# Altium project Universal_Full_Bridge.PrjPcb
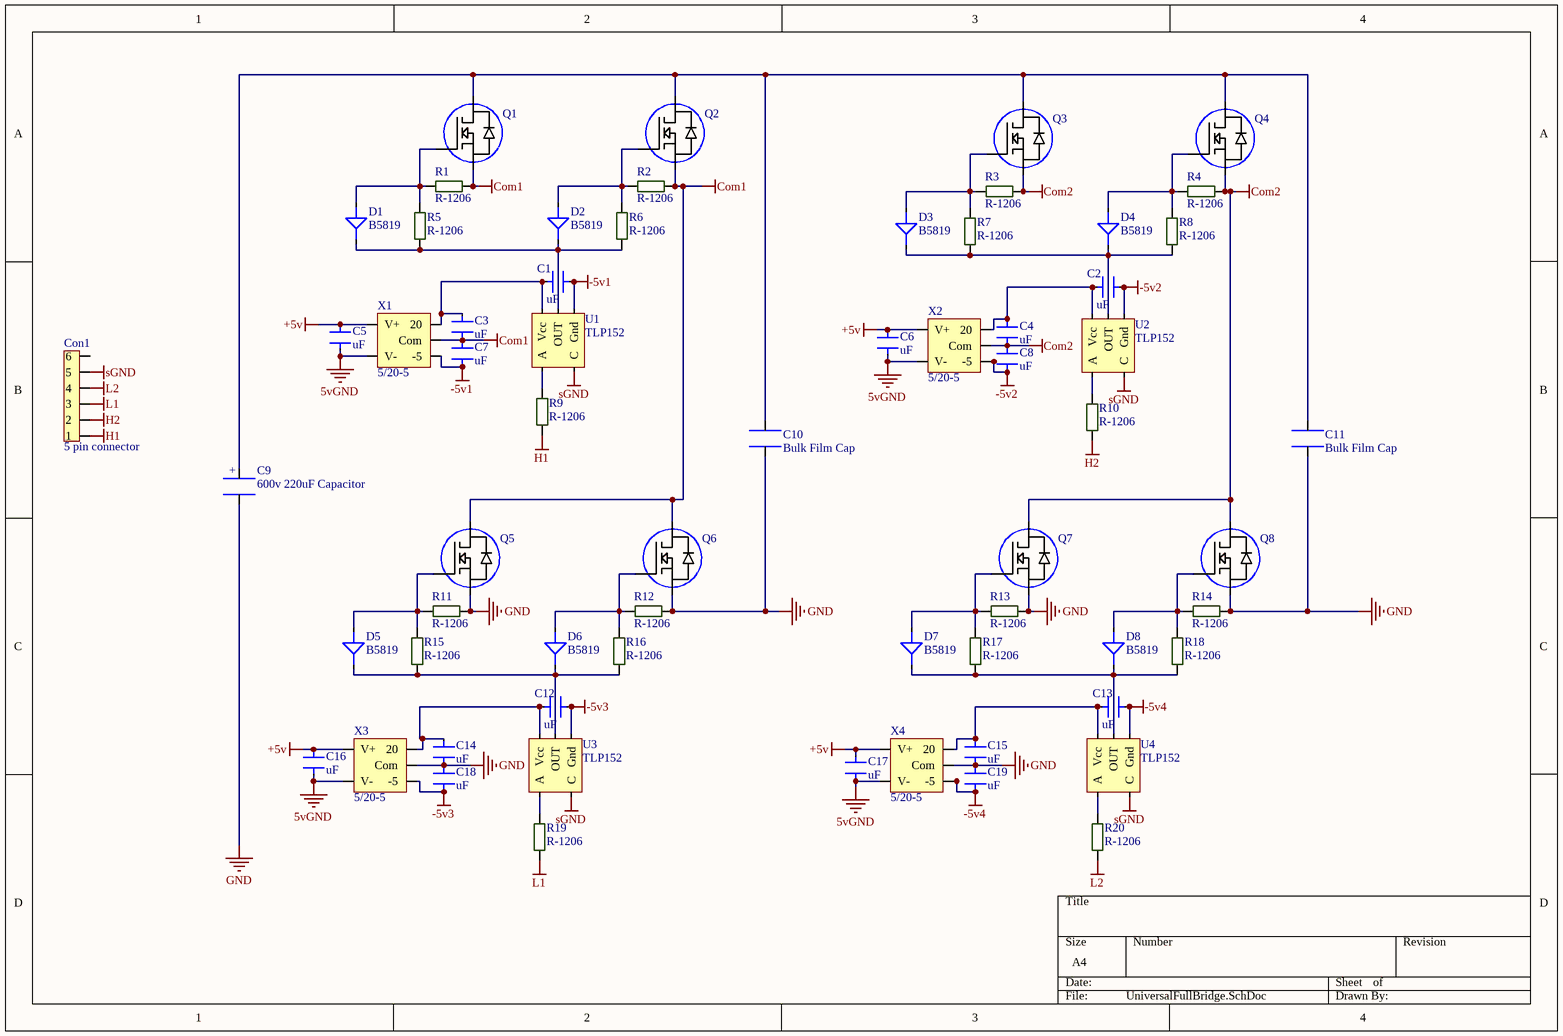
[diagram p0: UniversalFullBridge.SchDoc]
1 sheet, 64 parts. Net scope: global (net labels, ports and power ports of the same name join across sheets).
Board file: UniversalFullBridge.PcbDoc

## Sheet UniversalFullBridge.SchDoc
size A4; SheetNumber: 1; SheetTotal: 1

### Parts
C1  uF  [C-1206W]
C2  uF  [C-1206W]
C3  uF  [C-1206W]
C4  uF  [C-1206W]
C5  uF  [C-1206W]
C6  uF  [C-1206W]
C7  uF  [C-1206W]
C8  uF  [C-1206W]
C9  600v 220uF Capacitor  [600v Capacitor]
C10  Bulk Film Cap  [Bulk cappacitor]
C11  Bulk Film Cap  [Bulk cappacitor]
C12  uF  [C-1206W]
C13  uF  [C-1206W]
C14  uF  [C-1206W]
C15  uF  [C-1206W]
C16  uF  [C-1206W]
C17  uF  [C-1206W]
C18  uF  [C-1206W]
C19  uF  [C-1206W]
Con1  5 pin connector  [pinheader]
D1  B5819  [B5819]
D2  B5819  [B5819]
D3  B5819  [B5819]
D4  B5819  [B5819]
D5  B5819  [B5819]
D6  B5819  [B5819]
D7  B5819  [B5819]
D8  B5819  [B5819]
Q1  To263Mosfet  [To263Mosfet]  (value not drawn)
Q2  To263Mosfet  [To263Mosfet]  (value not drawn)
Q3  To263Mosfet  [To263Mosfet]  (value not drawn)
Q4  To263Mosfet  [To263Mosfet]  (value not drawn)
Q5  To263Mosfet  [To263Mosfet]  (value not drawn)
Q6  To263Mosfet  [To263Mosfet]  (value not drawn)
Q7  To263Mosfet  [To263Mosfet]  (value not drawn)
Q8  To263Mosfet  [To263Mosfet]  (value not drawn)
R1  R-1206  [R-1206W]
R2  R-1206  [R-1206W]
R3  R-1206  [R-1206W]
R4  R-1206  [R-1206W]
R5  R-1206  [R-1206W]
R6  R-1206  [R-1206W]
R7  R-1206  [R-1206W]
R8  R-1206  [R-1206W]
R9  R-1206  [R-1206W]
R10  R-1206  [R-1206W]
R11  R-1206  [R-1206W]
R12  R-1206  [R-1206W]
R13  R-1206  [R-1206W]
R14  R-1206  [R-1206W]
R15  R-1206  [R-1206W]
R16  R-1206  [R-1206W]
R17  R-1206  [R-1206W]
R18  R-1206  [R-1206W]
R19  R-1206  [R-1206W]
R20  R-1206  [R-1206W]
U1  TLP152  [tlp152]
U2  TLP152  [tlp152]
U3  TLP152  [tlp152]
U4  TLP152  [tlp152]
X1  5/20-5  [sip7DCDC converter]
X2  5/20-5  [sip7DCDC converter]
X3  5/20-5  [sip7DCDC converter]
X4  5/20-5  [sip7DCDC converter]

### Nets
5vGND: C5.1 C6.1 C16.1 C17.1 X1.2(V-) X2.2(V-) X3.2(V-) X4.2(V-)
+5v: C5.2 C6.2 C16.2 C17.2 X1.1(V+) X2.1(V+) X3.1(V+) X4.1(V+)
-5v1: C1.2 C7.1 U1.4(Gnd) X1.5(-5)
-5v2: C2.2 C8.1 U2.4(Gnd) X2.5(-5)
-5v3: C12.2 C18.1 U3.4(Gnd) X3.5(-5)
-5v4: C13.2 C19.1 U4.4(Gnd) X4.5(-5)
Com1: C3.1 C7.2 Q1.3(S) Q2.3(S) Q5.2(D) Q6.2(D) R1.1 R2.1 X1.6(Com)
Com2: C4.1 C8.2 Q3.3(S) Q4.3(S) Q7.2(D) Q8.2(D) R3.1 R4.1 X2.6(Com)
GND: C9.2 C10.2 C11.2 C14.1 C15.1 C18.2 C19.2 Q5.3(S) Q6.3(S) Q7.3(S) Q8.3(S) R11.1 R12.1 R13.1 R14.1 X3.6(Com) X4.6(Com)
H1: Con1.1 R9.1
H2: Con1.2 R10.1
L1: Con1.3 R19.1
L2: Con1.4 R20.1
sGND: Con1.5 U1.3(C) U2.3(C) U3.3(C) U4.3(C)
NetC1_1: C1.1 C3.2 U1.6(Vcc) X1.7(20)
NetC2_1: C2.1 C4.2 U2.6(Vcc) X2.7(20)
NetC9_1: C9.1 C10.1 C11.1 Q1.2(D) Q2.2(D) Q3.2(D) Q4.2(D)
NetC12_1: C12.1 C14.2 U3.6(Vcc) X3.7(20)
NetC13_1: C13.1 C15.2 U4.6(Vcc) X4.7(20)
NetD1_1: D1.1 D2.1 R5.1 R6.1 U1.5(OUT)
NetD1_2: D1.2 Q1.1(G) R1.2 R5.2
NetD2_2: D2.2 Q2.1(G) R2.2 R6.2
NetD3_1: D3.1 D4.1 R7.1 R8.1 U2.5(OUT)
NetD3_2: D3.2 Q3.1(G) R3.2 R7.2
NetD4_2: D4.2 Q4.1(G) R4.2 R8.2
NetD5_1: D5.1 D6.1 R15.1 R16.1 U3.5(OUT)
NetD5_2: D5.2 Q5.1(G) R11.2 R15.2
NetD6_2: D6.2 Q6.1(G) R12.2 R16.2
NetD7_1: D7.1 D8.1 R17.1 R18.1 U4.5(OUT)
NetD7_2: D7.2 Q7.1(G) R13.2 R17.2
NetD8_2: D8.2 Q8.1(G) R14.2 R18.2
NetR9_2: R9.2 U1.1(A)
NetR10_2: R10.2 U2.1(A)
NetR19_2: R19.2 U3.1(A)
NetR20_2: R20.2 U4.1(A)

Not connected (* = marked no-connect by the designer): Con1 6

### Notes on the sheet
- (in symbol 600v 220uF Capacitor) +

### Library data of the parts
C1-C8 C12-C19 = C-1206
C10 C11 = 3300pF Bulk Capacitor
R1-R20 = R-1206: Res1206
X1-X4 = DC/DC Coınverter